# EAGLE design duplikasi_PCB (EAGLE 9.6.2)
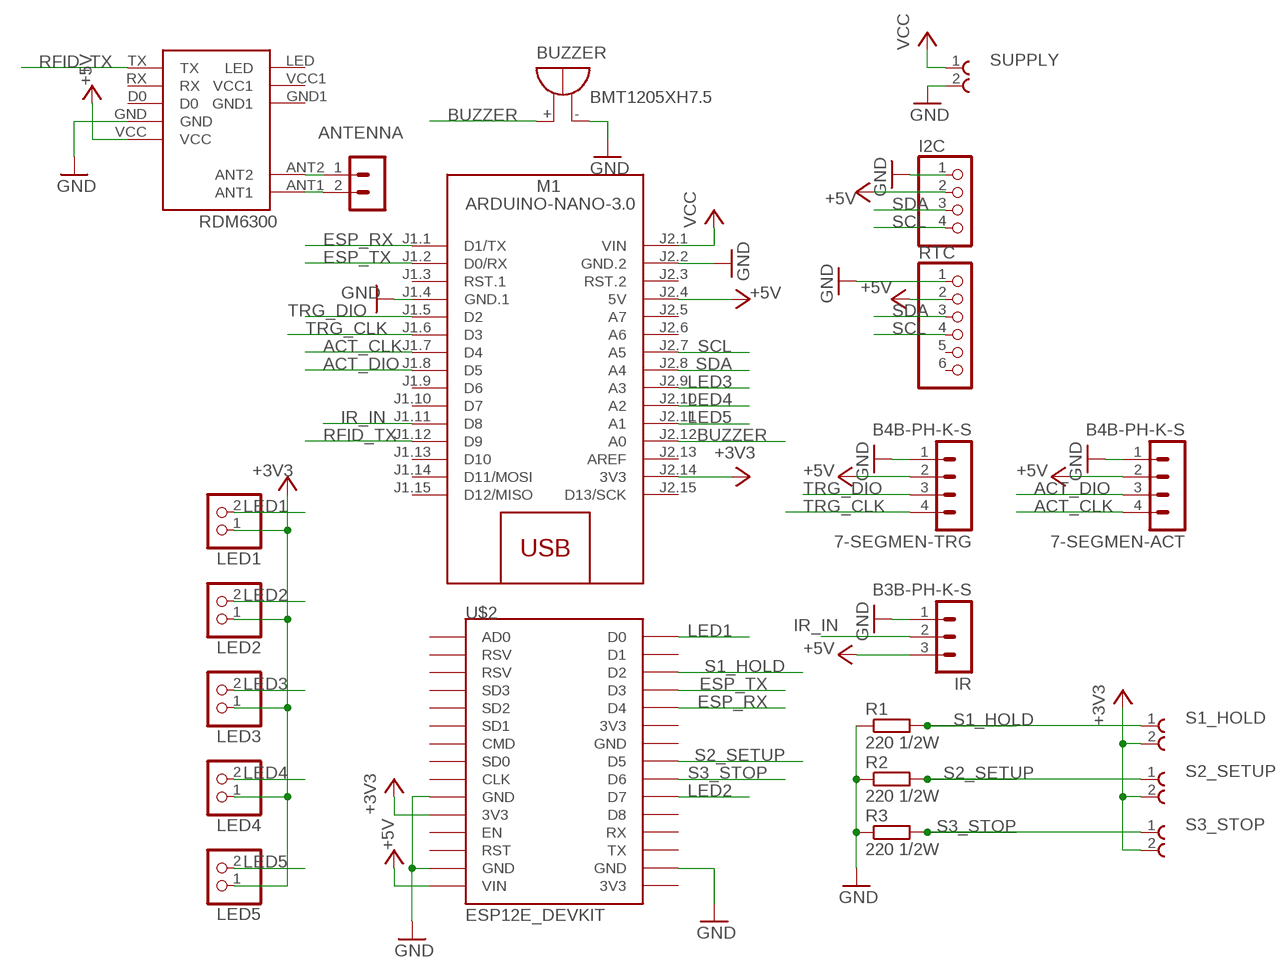
[diagram p0: schematic, sheet 1]

## Parts
7-SEGMEN-ACT  B4B-PH-K-S  [B4B-PH-K-S]
7-SEGMEN-TRG  B4B-PH-K-S  [B4B-PH-K-S]
ANTENNA  B2B-PH-K-S  [B2B-PH-K-S]
BUZZER  BMT1205XH7.5  [BMT1205XH7.5]
I2C  PINHD-1X4  [1X04]
IR  B3B-PH-K-S  [B3B-PH-K-S]
LED1  PINHD-1X2  [1X02]
LED2  PINHD-1X2  [1X02]
LED3  PINHD-1X2  [1X02]
LED4  PINHD-1X2  [1X02]
LED5  PINHD-1X2  [1X02]
M1  ARDUINO-NANO-3.0  [ARDUINO-NANO-3.0]
R1  220 1/2W  R-EU_0207/10  [0207/10]
R2  220 1/2W  R-EU_0207/10  [0207/10]
R3  220 1/2W  R-EU_0207/10  [0207/10]
RDM1  RDM6300  [RDM6300]
RTC  PINHD-1X6  [1X06]
S1_HOLD  691101710002  [691101710002]
S2_SETUP  691101710002  [691101710002]
S3_STOP  691101710002  [691101710002]
SUPPLY  691101710002  [691101710002]
U$2  ESP12E_DEVKIT  [ESP12E_DEVKIT]

## Nets
+3V3: LED1.1 LED2.1 LED3.1 LED4.1 LED5.1 M1.J2.14(3V3) S1_HOLD.2 S2_SETUP.2 S3_STOP.2 U$2.3V3@0(3V3)
+5V: 7-SEGMEN-ACT.2 7-SEGMEN-TRG.2 I2C.2 IR.3 M1.J2.4(5V) RDM1.VCC RTC.2 U$2.VIN
ACT_CLK: 7-SEGMEN-ACT.4 M1.J1.7(D4)
ACT_DIO: 7-SEGMEN-ACT.3 M1.J1.8(D5)
BUZZER: BUZZER.+ M1.J2.12(A0)
ESP_RX: M1.J1.1(D1/TX) U$2.D4
ESP_TX: M1.J1.2(D0/RX) U$2.D3
GND: 7-SEGMEN-ACT.1 7-SEGMEN-TRG.1 BUZZER.- I2C.1 IR.1 M1.J1.4(GND.1) M1.J2.2(GND.2) R1.1 R2.1 R3.1 RDM1.GND RTC.1 SUPPLY.2 U$2.GND@0(GND) U$2.GND@1(GND) U$2.GND@3(GND)
IR_IN: IR.2 M1.J1.11(D8)
LED1: LED1.2 U$2.D0
LED2: LED2.2 U$2.D7
LED3: LED3.2 M1.J2.9(A3)
LED4: LED4.2 M1.J2.10(A2)
LED5: LED5.2 M1.J2.11(A1)
N$1: ANTENNA.1 RDM1.ANT2
N$2: ANTENNA.2 RDM1.ANT1
RFID_TX: M1.J1.12(D9) RDM1.TX
S1_HOLD: R1.2 S1_HOLD.1 U$2.D2
S2_SETUP: R2.2 S2_SETUP.1 U$2.D5
S3_STOP: R3.2 S3_STOP.1 U$2.D6
SCL: I2C.4 M1.J2.7(A5) RTC.4
SDA: I2C.3 M1.J2.8(A4) RTC.3
TRG_CLK: 7-SEGMEN-TRG.4 M1.J1.6(D3)
TRG_DIO: 7-SEGMEN-TRG.3 M1.J1.5(D2)
VCC: M1.J2.1(VIN) SUPPLY.1
Unconnected: M1.J1.3(RST.1) M1.J1.9(D6) M1.J1.10(D7) M1.J1.13(D10) M1.J1.14(D11/MOSI) M1.J1.15(D12/MISO) M1.J2.3(RST.2) M1.J2.5(A7) M1.J2.6(A6) M1.J2.13(AREF) M1.J2.15(D13/SCK) RDM1.D0 RDM1.GND1 RDM1.LED RDM1.RX RDM1.VCC1 RTC.5 RTC.6 U$2.3V3@1(3V3) U$2.3V3@2(3V3) U$2.AD0 U$2.CLK U$2.CMD U$2.D1 U$2.D8 U$2.EN U$2.GND@2(GND) U$2.RST U$2.RSV@0(RSV) U$2.RSV@1(RSV) U$2.RX U$2.SD0 U$2.SD1 U$2.SD2 U$2.SD3 U$2.TX

## Library data of the parts
7-SEGMEN-ACT 7-SEGMEN-TRG = con-JST PH:B4B-PH: JST PH series header 2.00mm pitch disconnectable crimp style connectors, vertical (side entry type), 4 pins
ANTENNA = con-JST PH:B2B-PH: JST PH series header 2.00mm pitch disconnectable crimp style connectors, vertical (side entry type), 2 pins
BUZZER = buzzer-diy:BMT1205XH7.5: MAGNETIC TRANSDUCER Source: Http:www.be-star.com; OC_FARNELL: unknown; OC_NEWARK: unknown
I2C = pinhead_small:PINHD-1X4: PIN HEADER
IR = con-JST PH:B3B-PH: JST PH series header 2.00mm pitch disconnectable crimp style connectors, vertical (side entry type), 3 pins
LED1-LED5 = pinhead_small:PINHD-1X2: PIN HEADER
M1 = diy-modules:ARDUINO-NANO-3.0: Arduino Nano 3.0 and compatible devices More details available here: https://www.arduino.cc/en/Main/ArduinoBoardNano Click here to find device on ebay.com <http://www.ebay.com/sch/arduino+nano>
R1-R3 = rcl:R-EU_: RESISTOR, European symbol; SPICEPREFIX: R
RDM1 = RFID-RDM6300:RDM6300: 125kHz RFID Reader Module
RTC = pinhead_small:PINHD-1X6: PIN HEADER
S1_HOLD S2_SETUP S3_STOP SUPPLY = Terminal Block 5mm:691101710002: WR-TBL Serie 101 - 5.0mm HOrizontal Entry Modular with Pressure Clamp - 2.5mm2 Wires , 2 pins=>Code : Con-TBL_Screw_PressureClamp_691101710002 <http://katalog.we-online.de/media/images/eican/Con-TBL_Screw_PressureClamp_6911017100xx_pf2.jpg> Details see: http://katalog.we-online.de/en/em/691_101_710_0xx Created 2014-06-16, Karrer Zheng 2014 (C) Würth Elektronik
U$2 = nodemcu:ESP12E_DEVKIT: ESP12E DEVKIT BOARD

## Board
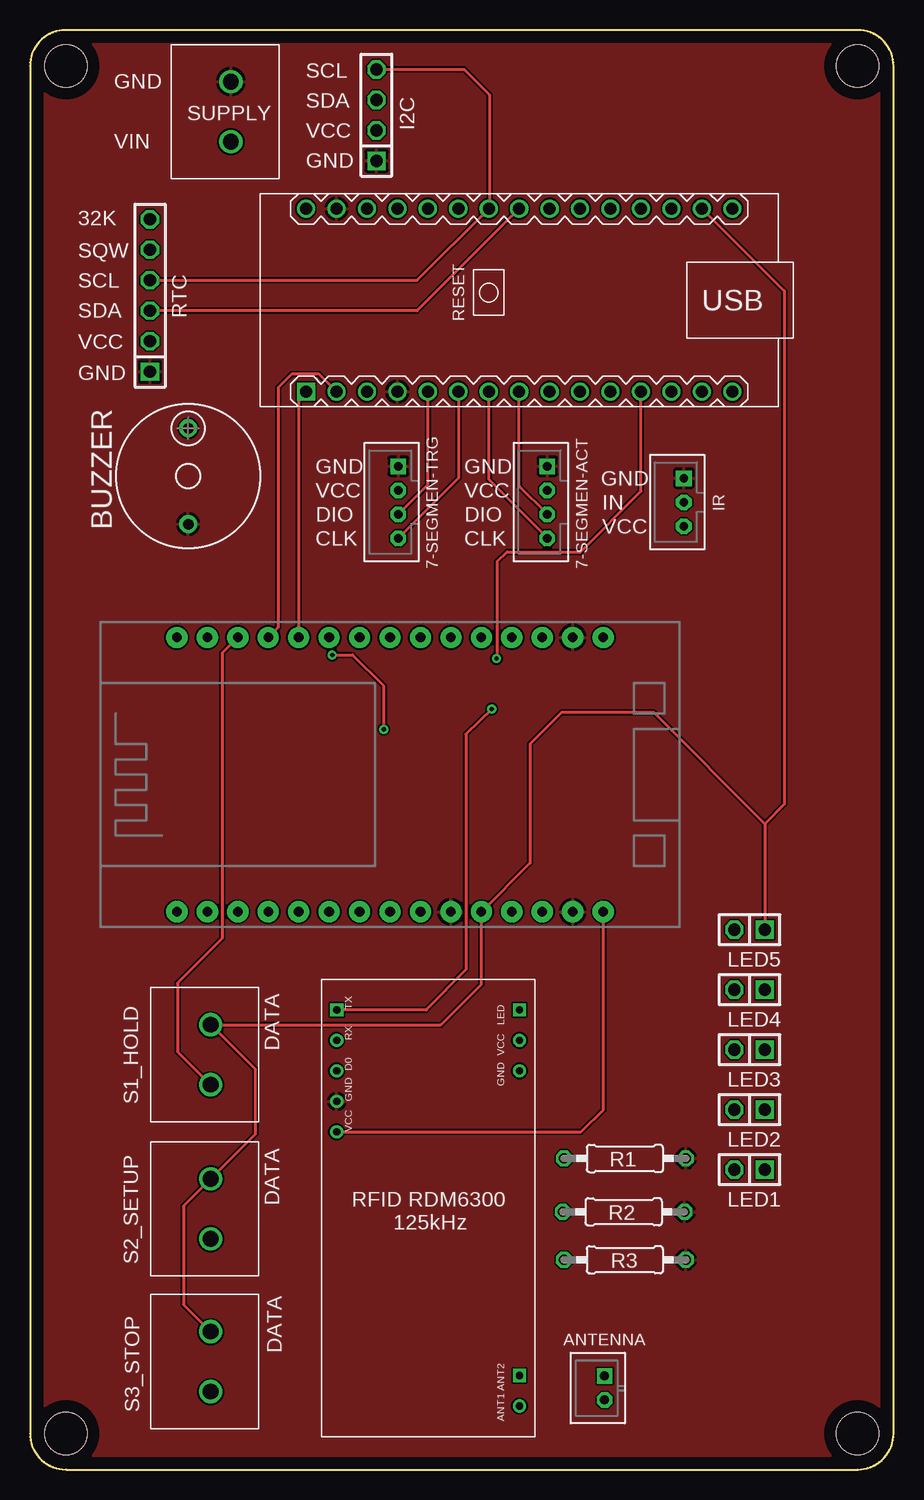
[diagram p1: board, top side]
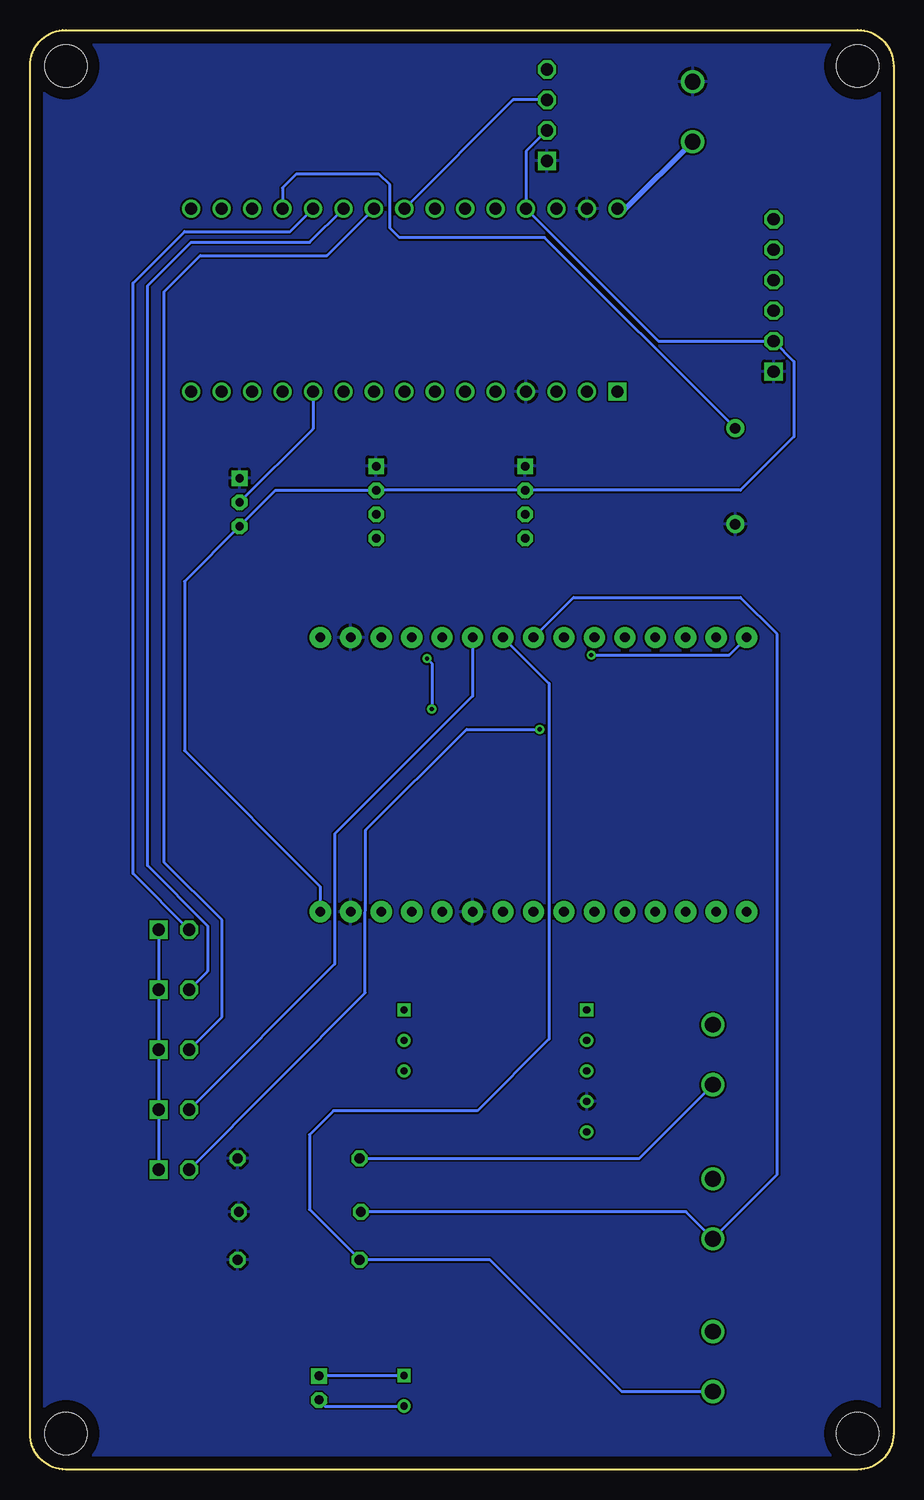
[diagram p2: board, bottom side, seen from below]

Size 72 x 120 mm. Coordinates in mm from the lower left corner, seen from the top.
Outline: 3,120 arc90 0,117 0,3 arc90 3,0 69,0 arc90 72,3 72,117 arc90 69,120 3,120
Copper layers (1*16): Top 0.035mm / dielectric 1.5mm / Bottom 0.035mm
Design rules "default": minimum track width 6mil, minimum drill 0.35mm, track to track 6mil, track to pad 6mil, pad to pad 6mil, via to via 6mil, smd to smd 6mil, copper to edge 40mil, drill to drill 6mil, minimum pad ring 10mil, minimum via ring 8mil, stop-mask expansion 4mil, vias tented up to drill 0mil, thermal gap 10mil
Holes 3.5 mm at 69,117 3,117 3,3 69,3

### Footprints (pad centres in the part's own frame; a part is rotated, then mirrored left to right if it is on the bottom)
B4B-PH-K-S = drill 0.7 pad 1.3 square: 1 3,0 | drill 0.7 pad 1.3 octagon: 2 1,0; 3 -1,0; 4 -3,0
B2B-PH-K-S = drill 0.75 pad 1.3 square: 1 1,0 | drill 0.75 pad 1.3 octagon: 2 -1,0
BMT1205XH7.5 = drill 0.9 pad 1.5: + 4,0; - -4,0
1X04 = drill 1.016 square: 1 -3.81,0 | drill 1.016 octagon: 2 -1.27,0; 3 1.27,0; 4 3.81,0
B3B-PH-K-S = drill 0.7 pad 1.3 square: 1 2,0 | drill 0.7 pad 1.3 octagon: 2 0,0; 3 -2,0
1X02 = drill 1.016 square: 1 -1.27,0 | drill 1.016 octagon: 2 1.27,0
ARDUINO-NANO-3.0 = drill 1 square: J1.1 17.78,7.62 | drill 1: J1.2 15.24,7.62; J1.3 12.7,7.62; J1.4 10.16,7.62; J1.5 7.62,7.62; J1.6 5.08,7.62; J1.7 2.54,7.62; J1.8 0,7.62; J1.9 -2.54,7.62; J1.10 -5.08,7.62; J1.11 -7.62,7.62; J1.12 -10.16,7.62; J1.13 -12.7,7.62; J1.14 -15.24,7.62; J1.15 -17.78,7.62; J2.1 17.78,-7.62; J2.2 15.24,-7.62; J2.3 12.7,-7.62; J2.4 10.16,-7.62; J2.5 7.62,-7.62; J2.6 5.08,-7.62; J2.7 2.54,-7.62; J2.8 0,-7.62; J2.9 -2.54,-7.62; J2.10 -5.08,-7.62; J2.11 -7.62,-7.62; J2.12 -10.16,-7.62; J2.13 -12.7,-7.62; J2.14 -15.24,-7.62; J2.15 -17.78,-7.62
0207/10 = drill 0.813 octagon: 1 -5.08,0; 2 5.08,0
RDM6300 = drill 0.6: ANT1 -16.51,-7.62; D0 11.43,7.62; GND 8.89,7.62; GND1 11.43,-7.62; RX 13.97,7.62; VCC 6.35,7.62; VCC1 13.97,-7.62 | drill 0.6 square: ANT2 -13.97,-7.62; LED 16.51,-7.62; TX 16.51,7.62
1X06 = drill 1.016 square: 1 -6.35,0 | drill 1.016 octagon: 2 -3.81,0; 3 -1.27,0; 4 1.27,0; 5 3.81,0; 6 6.35,0
691101710002 = drill 1.3: 1 -5,0; 2 0,0
ESP12E_DEVKIT = drill 0.8 pad 1.778: 3V3@0 -11.43,-7.62; 3V3@1 11.43,5.08; 3V3@2 11.43,-17.78; AD0 -11.43,17.78; CLK -11.43,-2.54; CMD -11.43,2.54; D0 11.43,17.78; D1 11.43,15.24; D2 11.43,12.7; D3 11.43,10.16; D4 11.43,7.62; D5 11.43,0; D6 11.43,-2.54; D7 11.43,-5.08; D8 11.43,-7.62; EN -11.43,-10.16; GND@0 -11.43,-5.08; GND@1 -11.43,-15.24; GND@2 11.43,2.54; GND@3 11.43,-15.24; RST -11.43,-12.7; RSV@0 -11.43,15.24; RSV@1 -11.43,12.7; RX 11.43,-10.16; SD0 -11.43,0; SD1 -11.43,5.08; SD2 -11.43,7.62; SD3 -11.43,10.16; TX 11.43,-12.7; VIN -11.43,-17.78

### Placement (x,y rotation side)
7-SEGMEN-ACT  43.14,80.64 90 top
7-SEGMEN-TRG  30.71,80.64 90 top
ANTENNA  47.9,6.8 90 top
BUZZER  13.2,82.8 90 top
I2C  28.89,112.9 90 top
IR  54.52,80.64 90 top
LED1  60,25 180 top
LED2  60,30 180 top
LED3  60,35 180 top
LED4  60,40 180 top
LED5  60,45 180 top
M1  40.79,97.48 180 top
R1  49.6,25.93 180 top
R2  49.5,21.48 180 top
R3  49.6,17.48 180 top
RDM1  33.2,21.8 90 top
RTC  10,97.87 90 top
S1_HOLD  15.06,37.07 90 top
S2_SETUP  15.06,24.23 90 top
S3_STOP  15.06,11.49 90 top
SUPPLY  16.75,115.69 90 top
U$2  30.02,57.93 90 top

### Tracks (layer width: path | path; a pad name or v marks a point on that pad's centre or on a via)
+3V3
  Top 0.254: 61.27,53.83 52,63.1 44.3,63.1 41.7,60.5 41.7,50.56 U$2.3V3@0 37.64,40.44 34.27,37.07 15.1,37.07 | 61.27,53.83 LED5.1 | M1.J2.14 62.9,98.23 62.9,55.46 61.27,53.83 | S1_HOLD.2 15.1,37.07 | 15.1,37.07 18.8,33.37 18.8,27.97 S2_SETUP.2 12.8,21.97 12.8,13.75 S3_STOP.2
  Bottom 0.254: LED5.1 LED4.1 LED3.1 LED2.1 LED1.1
+5V
  Top 0.254: RDM1.VCC 45.95,28.15 47.8,30 U$2.VIN
  Bottom 0.254: I2C.2 30.63,109.89 M1.J2.4 19.59,94.06 RTC.2 8.3,92.36 8.3,86.1 12.76,81.64 7-SEGMEN-TRG.2 7-SEGMEN-ACT.2 51.52,81.64 IR.3 59.12,74.04 59.12,59.92 47.8,48.6 U$2.VIN
ACT_CLK
  Top 0.254: 7-SEGMEN-ACT.4 38.25,82.53 M1.J1.7
ACT_DIO
  Top 0.254: 7-SEGMEN-ACT.3 40.79,81.99 M1.J1.8
BUZZER
  Bottom 0.254: BUZZER.+ 29.1,102.7 41.2,102.7 42,103.5 42,107.1 42.9,108 49.8,108 50.95,106.85 M1.J2.12
ESP_RX
  Top 0.254: M1.J1.1 22.4,89.25 U$2.D4
ESP_TX
  Top 0.254: M1.J1.2 24.11,91.3 21.8,91.3 20.7,90.2 20.7,70.2 U$2.D3
GND
  pour Bottom: -1.1,122 -1.1,-3.3 77.3,-3.3 77.3,122
  pour Top: -1.1,122 -1.1,-3.3 77.3,-3.3 77.3,122
IR_IN
  Bottom 0.254: M1.J1.11 48.41,86.75 IR.2
LED1  (via drill 0.35)
  Top 0.254: v29.5,61.7 29.5,65.3 26.9,67.9 v25.2,67.9
  Bottom 0.254: LED1.2 44.04,39.75 44.01,53.29 35.6,61.7 v29.5,61.7 | v25.2,67.9 13.7,67.9 U$2.D0
LED2
  Bottom 0.254: U$2.D7 35.1,64.46 46.6,52.96 46.6,42.13 LED2.2
LED3
  Bottom 0.254: LED3.2 56,37.73 56,45.8 60.8,50.6 60.8,98.2 57.81,101.19 47.24,101.19 M1.J2.9
LED4
  Bottom 0.254: LED4.2 57.19,41.54 57.19,45.33 62.2,50.34 62.2,98.67 58.57,102.3 48.67,102.3 M1.J2.10
LED5
  Bottom 0.254: LED5.2 63.4,49.67 63.4,98.91 59.11,103.2 50.31,103.2 M1.J2.11
N$1
  Bottom 0.254: RDM1.ANT2 47.87,7.83 ANTENNA.1
N$2
  Bottom 0.254: ANTENNA.2 47.39,5.29 RDM1.ANT1
RFID_TX  (via drill 0.35)
  Top 0.254: v38.5,63.4 36.35,61.3 36.35,41.68 33.03,38.31 RDM1.TX | v38.9,67.6 38.95,67.66 38.95,75.68 39.78,76.5 45.9,76.5 50.95,81.55 M1.J1.12
  Bottom 0.254: v38.9,67.6 38.5,67.2 v38.5,63.4
S1_HOLD
  Top 0.254: U$2.D2 16.03,68.06 16.03,44.28 12.3,40.56 12.3,34.83 S1_HOLD.1
  Bottom 0.254: S1_HOLD.1 21.2,25.93 R1.2
S2_SETUP
  Bottom 0.254: U$2.D5 26.68,72.7 12.76,72.7 9.7,69.64 9.7,24.59 S2_SETUP.1 17.31,21.48 R2.2
S3_STOP
  Bottom 0.254: R3.2 44.5,17.48 | 44.5,17.48 33.65,17.48 22.66,6.49 S3_STOP.1 | U$2.D6 28.72,65.53 28.72,35.88 34.7,29.9 46.7,29.9 48.7,27.9 48.7,21.68 44.5,17.48
SCL
  Top 0.254: RTC.4 32.29,99.14 M1.J2.7 38.3,105.15 38.3,114.6 36.19,116.71 I2C.4
SDA
  Top 0.254: M1.J2.8 32.29,96.6 RTC.3
  Bottom 0.254: I2C.3 31.72,114.17 M1.J2.8
TRG_CLK
  Top 0.254: M1.J1.6 35.71,82.64 7-SEGMEN-TRG.4
TRG_DIO
  Top 0.254: 7-SEGMEN-TRG.3 33.17,82.1 M1.J1.5
VCC
  Bottom 0.406: SUPPLY.1 22.34,105.1 M1.J2.1

### Text on the board
tPlace: SCL | GND | SDA | VCC | VIN | GND | 32K | SQW | SCL | SDA | VCC | GND | GND | GND | GND | VCC | VCC | IN | DIO | DIO | VCC | CLK | CLK | DATA | DATA | RFID RDM6300 / 125kHz | DATA